# Altium schematic sheet Weapon_Motor.SchDoc
size A; SheetNumber: 1; SheetTotal: 2
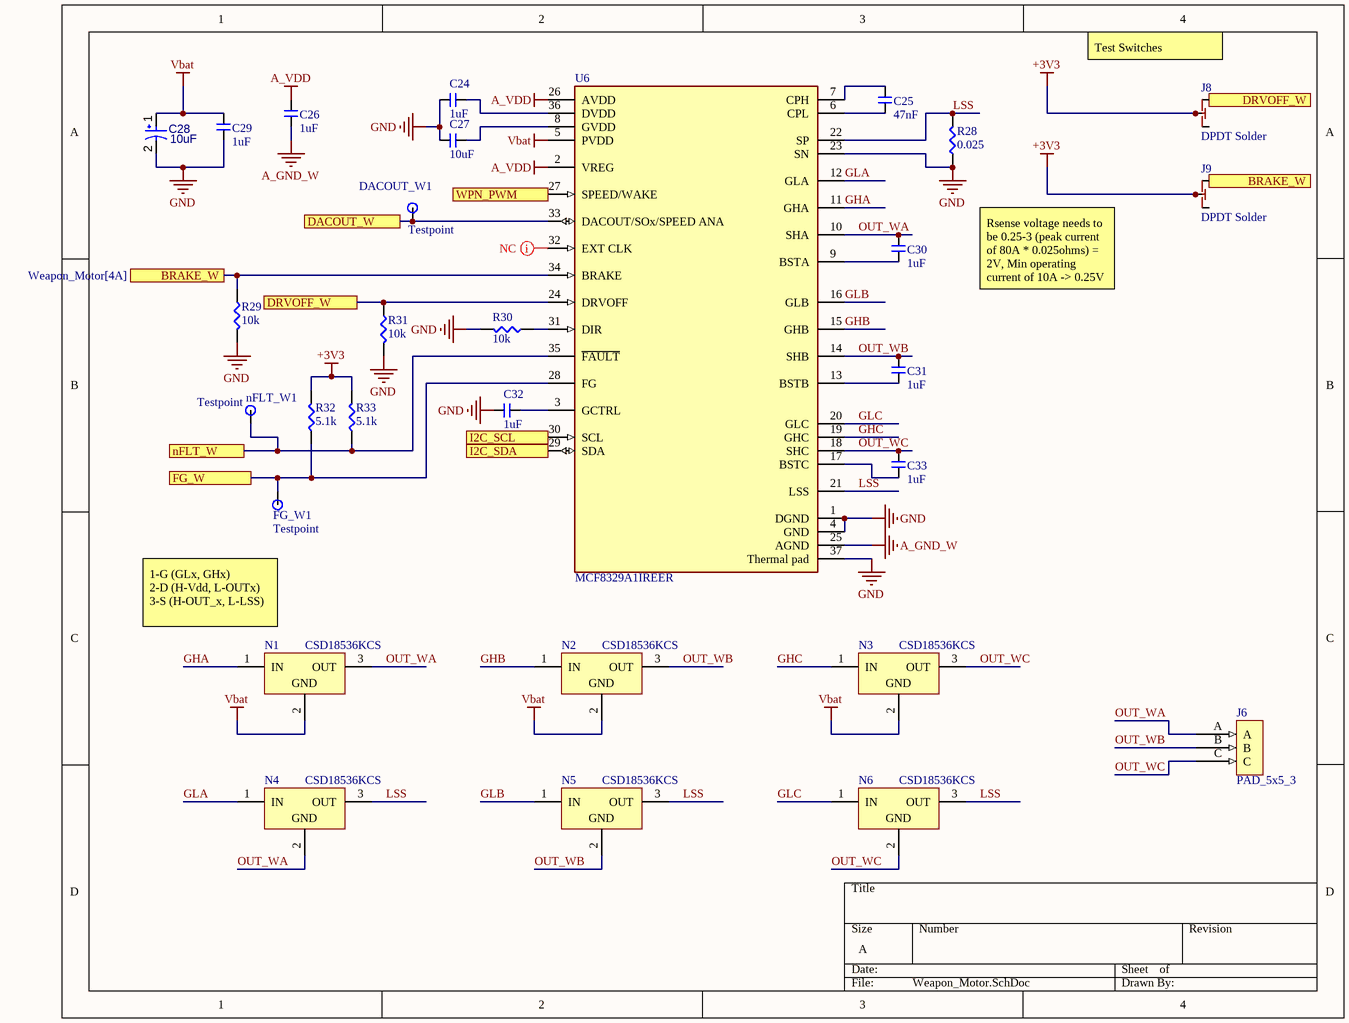
[diagram p0: Weapon_Motor.SchDoc]

## Parts
C24  1uF  [CAP-0603]
C25  47nF  [CAP-0603]
C26  1uF  [CAP-0603]
C27  10uF  [CAP-0603]
C28  10uF  [EEF-CX1E330R-Footprint-1]
C29  1uF  [CAP-0603]
C30  1uF  [CAP-0603]
C31  1uF  [CAP-0603]
C32  1uF  [CAP-0603]
C33  1uF  [CAP-0603]
DACOUT_W1  Testpoint  [Testpoint]
FG_W1  Testpoint  [Testpoint]
J6  PAD_5x5_3  [PAD_5x5_3-Footprint-1]
J8  DPDT Solder  [DPDT Solder]
J9  DPDT Solder  [DPDT Solder]
N1  CSD18536KCS  [TO220]
N2  CSD18536KCS  [TO220]
N3  CSD18536KCS  [TO220]
N4  CSD18536KCS  [TO220]
N5  CSD18536KCS  [TO220]
N6  CSD18536KCS  [TO220]
nFLT_W1  Testpoint  [Testpoint]
R28  0.025  [RES-2512]
R29  10k  [RES-0603]
R30  10k  [RES-0603]
R31  10k  [RES-0603]
R32  5.1k  [RES-0603]
R33  5.1k  [RES-0603]
U6  MCF8329A1IREER  [FP-REE0036A-MFG]

## Ports
BRAKE_W (see Weapon_Motor[1B]), BRAKE_W (see Weapon_Motor[4A]), DACOUT_W, DRVOFF_W (see Weapon_Motor[1B]), DRVOFF_W (see Weapon_Motor[4A]), FG_W, I2C_SCL (see Drive_Motors[1D], Drive_Motors[2D], Drive_Motors[4D]), I2C_SDA (see Drive_Motors[1D], Drive_Motors[2D], Drive_Motors[4D]), nFLT_W, WPN_PWM

## Nets
+3V3: J8.3 J9.3 R32.2 R33.2
A_GND_W: C26.2 U6.25(AGND)
A_VDD: C26.1 U6.2(VREG) U6.26(AVDD)
GND: C24.2 C27.2 C28.2 C29.2 C32.2 R28.1 R29.2 R30.2 R31.2 U6.1(DGND) U6.4(GND) U6.23(SN) U6.37(Thermal_pad)
Vbat: C28.1 C29.1 N1.2(GND) N2.2(GND) N3.2(GND) U6.5(PVDD)
BRAKE_W: J9.1 R29.1 U6.34(BRAKE) ; port BRAKE_W
DACOUT_W: DACOUT_W1.1 U6.33(DACOUT/SOx/SPEED_ANA) ; port DACOUT_W
DRVOFF_W: J8.1 R31.1 U6.24(DRVOFF) ; port DRVOFF_W
FG_W: FG_W1.1 R32.1 U6.28(FG) ; port FG_W
GHA: N1.1(IN) U6.11(GHA)
GHB: N2.1(IN) U6.15(GHB)
GHC: N3.1(IN) U6.19(GHC)
GLA: N4.1(IN) U6.12(GLA)
GLB: N5.1(IN) U6.16(GLB)
GLC: N6.1(IN) U6.20(GLC)
I2C_SCL: U6.30(SCL) ; port I2C_SCL
I2C_SDA: U6.29(SDA) ; port I2C_SDA
LSS: N4.3(OUT) N5.3(OUT) N6.3(OUT) R28.2 U6.21(LSS) U6.22(SP)
nFLT_W: nFLT_W1.1 R33.1 U6.35(~{FAULT}) ; port nFLT_W
OUT_WA: C30.1 J6.A N1.3(OUT) N4.2(GND) U6.10(SHA)
OUT_WB: C31.1 J6.B N2.3(OUT) N5.2(GND) U6.14(SHB)
OUT_WC: C33.1 J6.C N3.3(OUT) N6.2(GND) U6.18(SHC)
WPN_PWM: U6.27(SPEED/WAKE) ; port WPN_PWM
NetC24_1: C24.1 U6.36(DVDD)
NetC25_1: C25.1 U6.7(CPH)
NetC25_2: C25.2 U6.6(CPL)
NetC27_1: C27.1 U6.8(GVDD)
NetC30_2: C30.2 U6.9(BSTA)
NetC31_2: C31.2 U6.13(BSTB)
NetC32_1: C32.1 U6.3(GCTRL)
NetC33_2: C33.2 U6.17(BSTC)
NetR30_1: R30.1 U6.31(DIR)

Not connected (* = marked no-connect by the designer): J8 2; J9 2; U6 32(EXT_CLK)

## Layout directives
mark named NC: NetU6_32

## Notes on the sheet
- (near J8) Test Switches
- Rsense voltage needs to be 0.25-3 (peak current of 80A * 0.025ohms) = 2V, Min operating current of 10A -> 0.25V
- 1-G (GLx, GHx)
  2-D (H-Vdd, L-OUTx)
  3-S (H-OUT_x, L-LSS)

## Library data of the parts
C24 C26 C27 C29-C33 = CMP-009-000303-1: X5R or X7R, 16V ceramic; Source: ife19_Elec_Library.SchLib; Design Item ID: CAP-0603
C25 = CMP-009-000303-1: X5R or X7R, >32V ceramic; Source: ife19_Elec_Library.SchLib; Design Item ID: CAP-0603
C28 = CMP-005-000585-1: Aluminum Electrolytic Capacitor, 10 uF, +/- 20%, 50 V, -40 to 85 degC, 2-Pin THD, RoHS, Bulk; Manufacturer: Panasonic; Design Item ID: CMP-001-00025-5; Source: Integrated_Library - 12.03.21 - 15.39.SchLib
DACOUT_W1 FG_W1 nFLT_W1 = CMP-009-000182-1: Design Item ID: Testpoint; Source: ife19_Elec_Library.SchLib
J6 = CMP-057-000231-1: 3 5x5mm pads; ComponentLink4Description: http://datasheet.octopart.com/172065-0308-Molex-datasheet-96710946.pdf?src-supplier=Farnell; ComponentLink1Description: http://datasheet.octopart.com/172065-0306-Molex-datasheet-101610458.pdf?src-supplier=Farnell; ComponentLink3Description: http://datasheet.octopart.com/172065-0308-Molex-datasheet-101610459.pdf?src-supplier=Farnell; ComponentLink2Description: http://datasheet.octopart.com/172065-0306-Molex-datasheet-96710945.pdf?src-supplier=Farnell
J8 J9 = CMP-081-000002-1: Source: LTC6811.SchLib; Design Item ID: DPDT Solder
N1-N6 = CMP-017-000018-1: Positive Voltage Regulator IC, 1.5 A, 5 V, 0 to 125 degC, 3-Pin TO-220, RoHS, Tube; Manufacturer: STMicroelectronics; Output Current: 1.5A; Output Voltage: 5V; Max Input Voltage: 35V; Outputs: 1; Min Supply Voltage: 8V; Dropout Voltage: 2V; Max Supply Voltage: 20V; Min Input Voltage: 7V; Case/Package: TO-220; Package Quantity: 50; Design Item ID: CMP-019-00018-2; Nominal Output Voltage: 5V; Source: Integrated_Library - 12.03.21 - 15.39.SchLib; Max Ouput Current: 1.5A; Packaging: Rail/Tube; Pins: 3; Mounting Technology: TH
R28 = CMP-055-000217-1: RES-2512; Source: ife19_Elec_Library.SchLib; Design Item ID: RES-2512
R29-R33 = CMP-014-000032-1: Source: ife19_Elec_Library.SchLib; Design Item ID: RES-0603
U6 = CMP-00370-145502424-1: MCF8329A1IREER 60-V, sensorless, field-oriented control (FOC) three-phase BLDC gate driver 36-WQFN -40 to 125; Manufacturer Lifecycle Status: ACTIVE; Max Supply Voltage: 60V; Output Current: 2A; Min Supply Voltage: 4.5V; Max Junction Temperature (Tj): 150°C; Number of Outputs: 3; NexarPartId: 145502424; Length: 4mm; Thickness: 750µm; Ambient Temperature Range High: 125°C; Number of Pins: 36; Width: 5mm; Min Operating Temperature: -40°C; Max Operating Temperature: 125°C; Lifecycle Status: Production; Height: 800µm